# EAGLE design Pure Keys aec-pcb4-inprogress (EAGLE 9.3.1)

## Sheet 1 of 7: ATMEGA328P
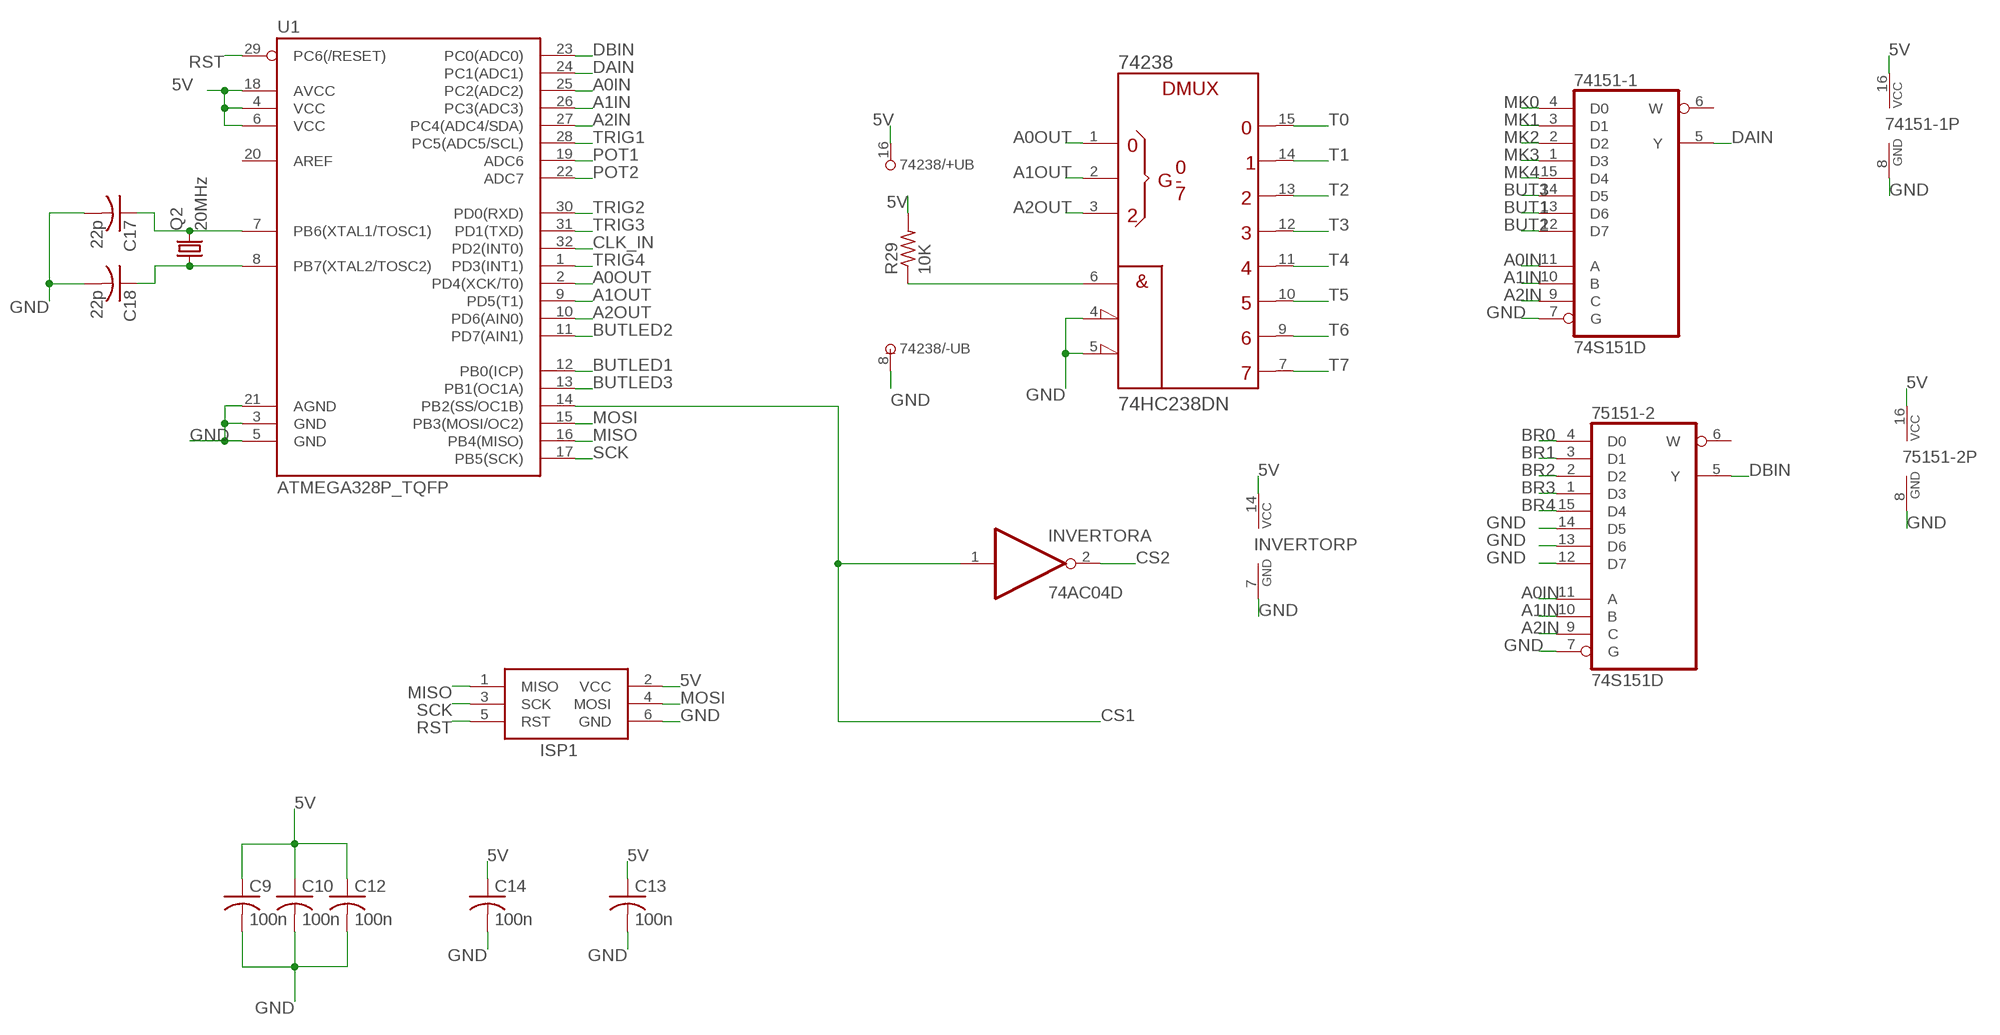
[diagram p0: schematic, sheet 1]

### Parts
74151-1  74S151D  [SO16]
74238  74HC238DN  [SO16]
75151-2  74S151D  [SO16]
C9  100n  C-USC0805K  [C0805K]
C10  100n  C-USC0805K  [C0805K]
C12  100n  C-USC0805K  [C0805K]
C13  100n  C-USC0805K  [C0805K]
C14  100n  C-USC0805K  [C0805K]
C17  22p  C-USC0805K  [C0805K]
C18  22p  C-USC0805K  [C0805K]
INVERTOR  74AC04D  [SO14]
ISP1  AVRISP-6  [AVRISP]
Q2  20MHz  CRYSTALHC49UP  [HC49UP]
R29  10K  R-US_R0805  [R0805]
U1  ATMEGA328P_TQFP  [TQFP32-08]

### Nets
5V [Power]: 74151-1.16(VCC) 74238.16(+UB) 75151-2.16(VCC) C9.1 C10.1 C12.1 C13.1 C14.1 INVERTOR.14(P:VCC) ISP1.2(VCC) R29.2 U1.4(VCC) U1.6(VCC) U1.18(AVCC) ; also sheet 2,4,5,6,7
A0IN [D-Pin]: 74151-1.11(A) 75151-2.11(A) U1.25(PC2(ADC2))
A0OUT: 74238.1(A) U1.2(PD4(XCK/T0))
A1IN [D-Pin]: 74151-1.10(B) 75151-2.10(B) U1.26(PC3(ADC3))
A1OUT [D-Pin]: 74238.2(B) U1.9(PD5(T1))
A2IN [D-Pin]: 74151-1.9(C) 75151-2.9(C) U1.27(PC4(ADC4/SDA))
A2OUT [D-Pin]: 74238.3(C) U1.10(PD6(AIN0))
BR0: 75151-2.4(D0) ; also sheet 3
BR1: 75151-2.3(D1) ; also sheet 3
BR2: 75151-2.2(D2) ; also sheet 3
BR3: 75151-2.1(D3) ; also sheet 3
BR4: 75151-2.15(D4) ; also sheet 3
BUT1: 74151-1.13(D6) ; also sheet 6
BUT2: 74151-1.12(D7) ; also sheet 6
BUT3: 74151-1.14(D5) ; also sheet 6
BUTLED1 [D-Pin]: U1.12(PB0(ICP)) ; also sheet 6
BUTLED2 [D-Pin]: U1.11(PD7(AIN1)) ; also sheet 6
BUTLED3 [D-Pin]: U1.13(PB1(OC1A)) ; also sheet 6
CLK_IN: U1.32(PD2(INT0)) ; also sheet 7
CS1 [D-Pin]: INVERTOR.1(A:I) U1.14(PB2(SS/OC1B)) ; also sheet 5
CS2: INVERTOR.2(A:O) ; also sheet 5
DAIN [D-Pin]: 74151-1.5(Y) U1.24(PC1(ADC1))
DBIN: 75151-2.5(Y) U1.23(PC0(ADC0))
ENOUT1: 74238.6(G1) R29.1
GND [Power]: 74151-1.7(G) 74151-1.8(GND) 74238.4(!G2A) 74238.5(!G2B) 74238.8(-UB) 75151-2.7(G) 75151-2.8(GND) 75151-2.12(D7) 75151-2.13(D6) 75151-2.14(D5) C9.2 C10.2 C12.2 C13.2 C14.2 C17.2 C18.2 INVERTOR.7(P:GND) ISP1.6(GND) U1.3(GND) U1.5(GND) U1.21(AGND) ; also sheet 2,3,4,5,6,7
MISO [D-Pin]: ISP1.1(MISO) U1.16(PB4(MISO))
MK0: 74151-1.4(D0) ; also sheet 3
MK1: 74151-1.3(D1) ; also sheet 3
MK2: 74151-1.2(D2) ; also sheet 3
MK3: 74151-1.1(D3) ; also sheet 3
MK4: 74151-1.15(D4) ; also sheet 3
MOSI [D-Pin]: ISP1.4(MOSI) U1.15(PB3(MOSI/OC2)) ; also sheet 5
N$10 [D-Pin]: C17.1 Q2.2 U1.7(PB6(XTAL1/TOSC1))
N$11 [D-Pin]: C18.1 Q2.1 U1.8(PB7(XTAL2/TOSC2))
POT1 [D-Pin]: U1.19(ADC6) ; also sheet 6
POT2: U1.22(ADC7) ; also sheet 6
RST [D-Pin]: ISP1.5(RST) U1.29(PC6(/RESET))
SCK [D-Pin]: ISP1.3(SCK) U1.17(PB5(SCK)) ; also sheet 5
T0: 74238.15(Y0) ; also sheet 3
T1: 74238.14(Y1) ; also sheet 3
T2: 74238.13(Y2) ; also sheet 3
T3: 74238.12(Y3) ; also sheet 3
T4: 74238.11(Y4) ; also sheet 3
T5: 74238.10(Y5) ; also sheet 3
T6: 74238.9(Y6) ; also sheet 3
T7: 74238.7(Y7) ; also sheet 3
TRIG1 [D-Pin]: U1.28(PC5(ADC5/SCL)) ; also sheet 4
TRIG2 [D-Pin]: U1.30(PD0(RXD)) ; also sheet 4
TRIG3 [D-Pin]: U1.31(PD1(TXD)) ; also sheet 4
TRIG4: U1.1(PD3(INT1)) ; also sheet 4
Unconnected: 74151-1.6(W) 75151-2.6(W) INVERTOR.3(B:I) INVERTOR.4(B:O) INVERTOR.5(C:I) INVERTOR.6(C:O) INVERTOR.8(D:O) INVERTOR.9(D:I) INVERTOR.10(E:O) INVERTOR.11(E:I) INVERTOR.12(F:O) INVERTOR.13(F:I) U1.20(AREF)

## Sheet 2 of 7: Power
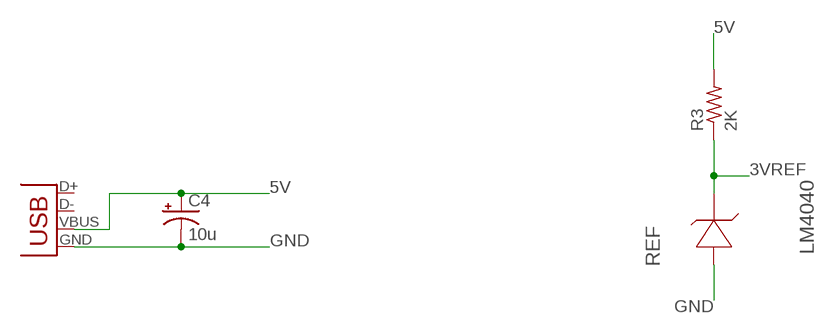
[diagram p1: schematic, sheet 2]

### Parts
C4  10u  CPOL-US153CLV-0505  [153CLV-0505]
JP2  USB-B  USBPTH  [USB-B-PTH]
R3  2K  R-US_R0805  [R0805]
REF  LM4040  LM4040A30IDBZT  [SOT95P237X112-3N]

### Nets
3VREF: R3.1 REF.1(CATHODE) ; also sheet 5
5V [Power]: C4.+ JP2.VBUS R3.2 ; also sheet 1,4,5,6,7
GND [Power]: C4.- JP2.GND REF.2(ANODE) ; also sheet 1,3,4,5,6,7
Unconnected: JP2.D+ JP2.D- REF.3(NC)

## Sheet 3 of 7: Keyboard Connector
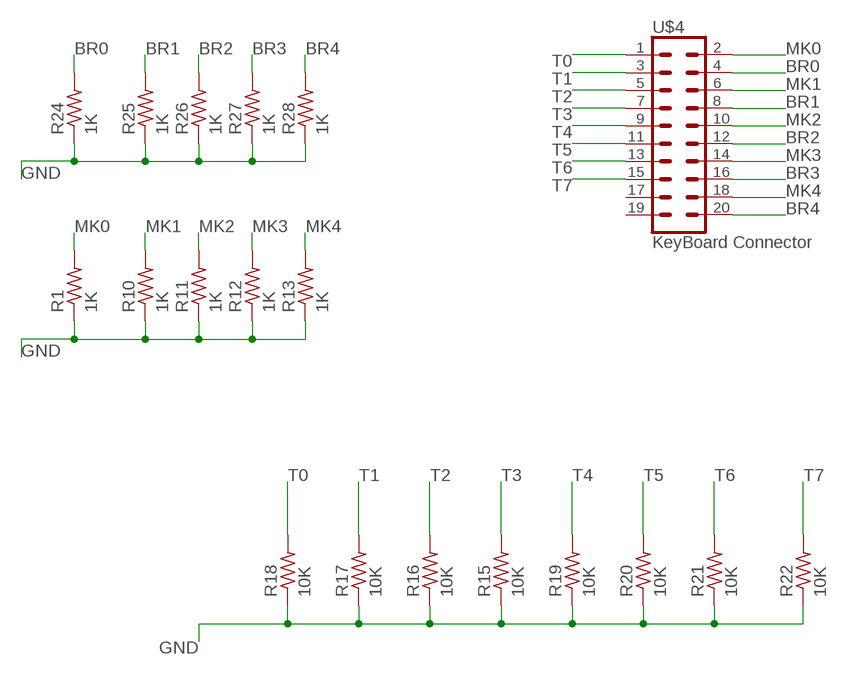
[diagram p2: schematic, sheet 3]

### Parts
R1  1K  R-US_R0805  [R0805]
R10  1K  R-US_R0805  [R0805]
R11  1K  R-US_R0805  [R0805]
R12  1K  R-US_R0805  [R0805]
R13  1K  R-US_R0805  [R0805]
R15  10K  R-US_R0805  [R0805]
R16  10K  R-US_R0805  [R0805]
R17  10K  R-US_R0805  [R0805]
R18  10K  R-US_R0805  [R0805]
R19  10K  R-US_R0805  [R0805]
R20  10K  R-US_R0805  [R0805]
R21  10K  R-US_R0805  [R0805]
R22  10K  R-US_R0805  [R0805]
R24  1K  R-US_R0805  [R0805]
R25  1K  R-US_R0805  [R0805]
R26  1K  R-US_R0805  [R0805]
R27  1K  R-US_R0805  [R0805]
R28  1K  R-US_R0805  [R0805]
U$4  KeyBoard Connector  CONN_10X2  [2X10]

### Nets
BR0: R24.2 U$4.4 ; also sheet 1
BR1: R25.2 U$4.8 ; also sheet 1
BR2: R26.2 U$4.12 ; also sheet 1
BR3: R27.2 U$4.16 ; also sheet 1
BR4: R28.2 U$4.20 ; also sheet 1
GND [Power]: R1.1 R10.1 R11.1 R12.1 R13.1 R15.1 R16.1 R17.1 R18.1 R19.1 R20.1 R21.1 R22.1 R24.1 R25.1 R26.1 R27.1 R28.1 ; also sheet 1,2,4,5,6,7
MK0: R1.2 U$4.2 ; also sheet 1
MK1: R10.2 U$4.6 ; also sheet 1
MK2: R11.2 U$4.10 ; also sheet 1
MK3: R12.2 U$4.14 ; also sheet 1
MK4: R13.2 U$4.18 ; also sheet 1
T0: R18.2 U$4.1 ; also sheet 1
T1: R17.2 U$4.3 ; also sheet 1
T2: R16.2 U$4.5 ; also sheet 1
T3: R15.2 U$4.7 ; also sheet 1
T4: R19.2 U$4.9 ; also sheet 1
T5: R20.2 U$4.11 ; also sheet 1
T6: R21.2 U$4.13 ; also sheet 1
T7: R22.2 U$4.15 ; also sheet 1
Unconnected: U$4.17 U$4.19

## Sheet 4 of 7: Triggers
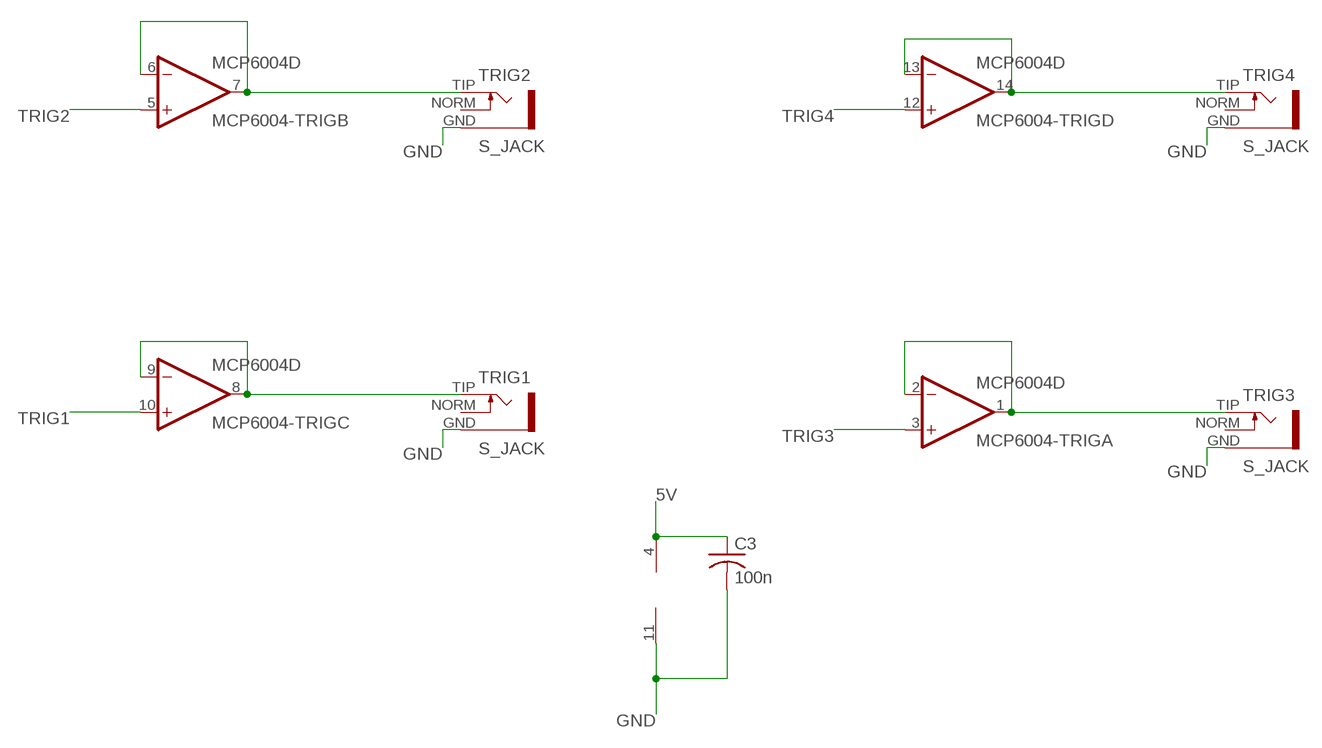
[diagram p3: schematic, sheet 4]

### Parts
C3  100n  C-USC0805K  [C0805K]
MCP6004-TRIG  MCP6004D  [SO14]
TRIG1  S_JACK  [S_JACK]
TRIG2  S_JACK  [S_JACK]
TRIG3  S_JACK  [S_JACK]
TRIG4  S_JACK  [S_JACK]

### Nets
5V [Power]: C3.1 MCP6004-TRIG.4(P:V+) ; also sheet 1,2,5,6,7
GND [Power]: C3.2 MCP6004-TRIG.11(P:V-) TRIG1.GND TRIG2.GND TRIG3.GND TRIG4.GND ; also sheet 1,2,3,5,6,7
N$3: MCP6004-TRIG.6(B:-IN) MCP6004-TRIG.7(B:OUT) TRIG2.TIP
N$4: MCP6004-TRIG.8(C:OUT) MCP6004-TRIG.9(C:-IN) TRIG1.TIP
N$5: MCP6004-TRIG.13(D:-IN) MCP6004-TRIG.14(D:OUT) TRIG4.TIP
N$6: MCP6004-TRIG.1(A:OUT) MCP6004-TRIG.2(A:-IN) TRIG3.TIP
TRIG1 [D-Pin]: MCP6004-TRIG.10(C:+IN) ; also sheet 1
TRIG2 [D-Pin]: MCP6004-TRIG.5(B:+IN) ; also sheet 1
TRIG3 [D-Pin]: MCP6004-TRIG.3(A:+IN) ; also sheet 1
TRIG4: MCP6004-TRIG.12(D:+IN) ; also sheet 1
Unconnected: TRIG1.NORM TRIG2.NORM TRIG3.NORM TRIG4.NORM

## Sheet 5 of 7: CV Out
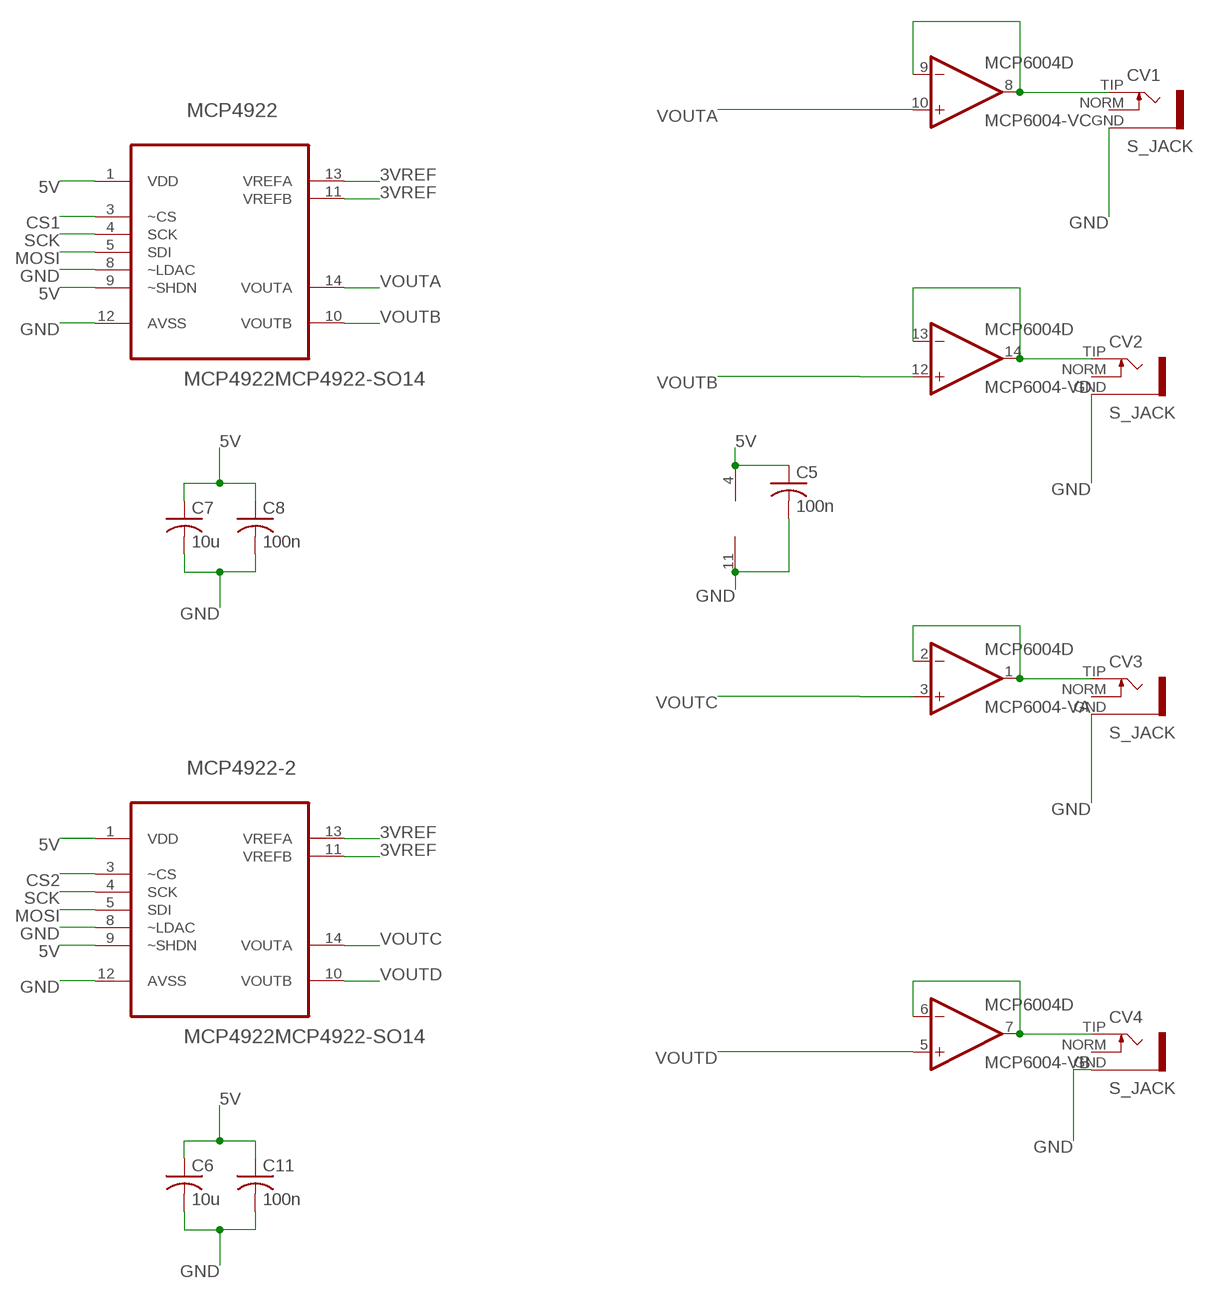
[diagram p4: schematic, sheet 5]

### Parts
C5  100n  C-USC0805K  [C0805K]
C6  10u  C-USC0805K  [C0805K]
C7  10u  C-USC0805K  [C0805K]
C8  100n  C-USC0805K  [C0805K]
C11  100n  C-USC0805K  [C0805K]
CV1  S_JACK  [S_JACK]
CV2  S_JACK  [S_JACK]
CV3  S_JACK  [S_JACK]
CV4  S_JACK  [S_JACK]
MCP4922  MCP4922MCP4922-SO14  [SO14]
MCP4922-2  MCP4922MCP4922-SO14  [SO14]
MCP6004-V  MCP6004D  [SO14]

### Nets
3VREF: MCP4922-2.11(VREFB) MCP4922-2.13(VREFA) MCP4922.11(VREFB) MCP4922.13(VREFA) ; also sheet 2
5V [Power]: C5.1 C6.1 C7.1 C8.1 C11.1 MCP4922-2.1(VDD) MCP4922-2.9(~SHDN) MCP4922.1(VDD) MCP4922.9(~SHDN) MCP6004-V.4(P:V+) ; also sheet 1,2,4,6,7
CS1 [D-Pin]: MCP4922.3(~CS) ; also sheet 1
CS2: MCP4922-2.3(~CS) ; also sheet 1
GND [Power]: C5.2 C6.2 C7.2 C8.2 C11.2 CV1.GND CV2.GND CV3.GND CV4.GND MCP4922-2.8(~LDAC) MCP4922-2.12(AVSS) MCP4922.8(~LDAC) MCP4922.12(AVSS) MCP6004-V.11(P:V-) ; also sheet 1,2,3,4,6,7
MOSI [D-Pin]: MCP4922-2.5(SDI) MCP4922.5(SDI) ; also sheet 1
N$7: CV1.TIP MCP6004-V.8(C:OUT) MCP6004-V.9(C:-IN)
N$25: CV4.TIP MCP6004-V.6(B:-IN) MCP6004-V.7(B:OUT)
N$31: CV3.TIP MCP6004-V.1(A:OUT) MCP6004-V.2(A:-IN)
N$36: CV2.TIP MCP6004-V.13(D:-IN) MCP6004-V.14(D:OUT)
SCK [D-Pin]: MCP4922-2.4(SCK) MCP4922.4(SCK) ; also sheet 1
VOUTA: MCP4922.14(VOUTA) MCP6004-V.10(C:+IN)
VOUTB: MCP4922.10(VOUTB) MCP6004-V.12(D:+IN)
VOUTC: MCP4922-2.14(VOUTA) MCP6004-V.3(A:+IN)
VOUTD: MCP4922-2.10(VOUTB) MCP6004-V.5(B:+IN)
Unconnected: CV1.NORM CV2.NORM CV3.NORM CV4.NORM

## Sheet 6 of 7: Pots and Buttons
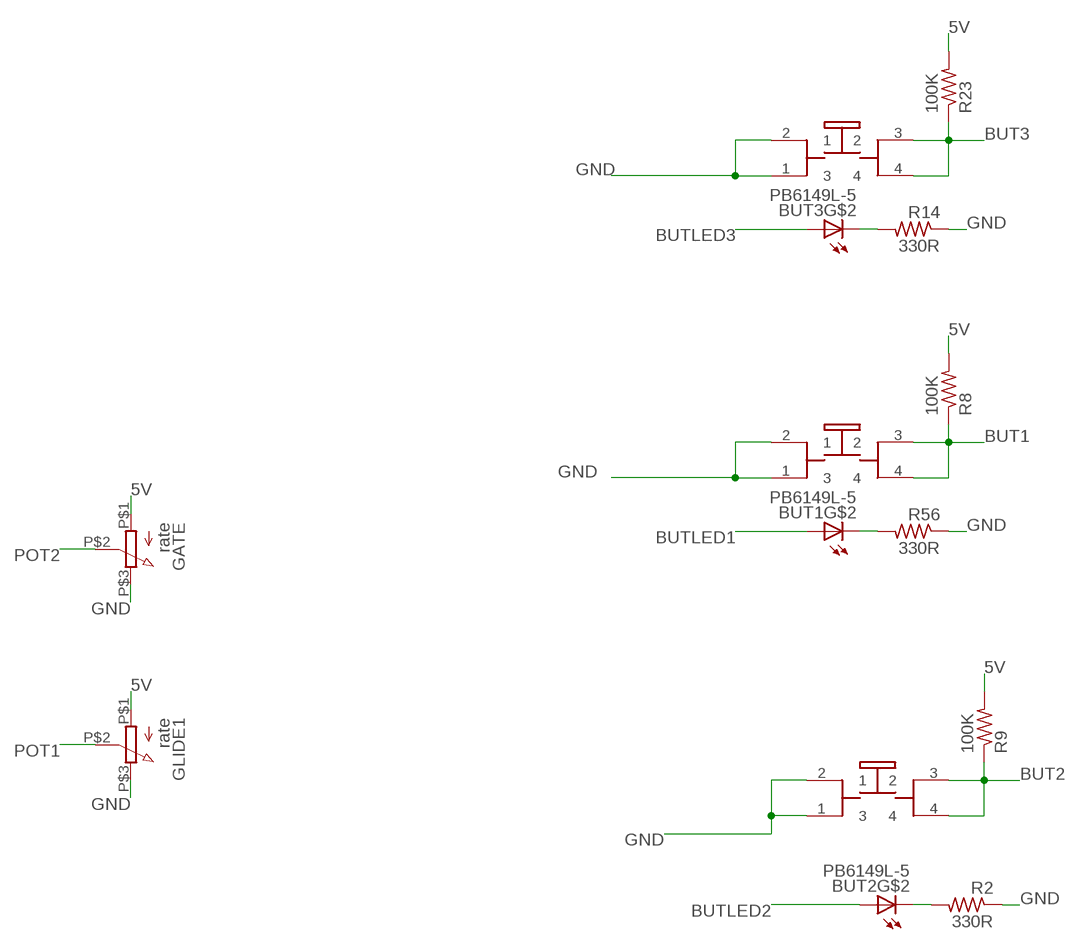
[diagram p5: schematic, sheet 6]

### Parts
BUT1  PB6149L-5  [PB6149L]
BUT2  PB6149L-5  [PB6149L]
BUT3  PB6149L-5  [PB6149L]
GATE  rate  9MMPOT  [POT]
GLIDE1  rate  9MMPOT  [POT]
R2  330R  R-US_R0805  [R0805]
R8  100K  R-US_R0805  [R0805]
R9  100K  R-US_R0805  [R0805]
R14  330R  R-US_R0805  [R0805]
R23  100K  R-US_R0805  [R0805]
R56  330R  R-US_R0805  [R0805]

### Nets
5V [Power]: GATE.P$1 GLIDE1.P$1 R8.2 R9.2 R23.2 ; also sheet 1,2,4,5,7
BUT1: BUT1.3 BUT1.4 R8.1 ; also sheet 1
BUT2: BUT2.3 BUT2.4 R9.1 ; also sheet 1
BUT3: BUT3.3 BUT3.4 R23.1 ; also sheet 1
BUTLED1 [D-Pin]: BUT1.A ; also sheet 1
BUTLED2 [D-Pin]: BUT2.A ; also sheet 1
BUTLED3 [D-Pin]: BUT3.A ; also sheet 1
GND [Power]: BUT1.1 BUT1.2 BUT2.1 BUT2.2 BUT3.1 BUT3.2 GATE.P$3 GLIDE1.P$3 R2.1 R14.1 R56.1 ; also sheet 1,2,3,4,5,7
N$1: BUT3.K(C) R14.2
N$8: BUT2.K(C) R2.2
N$65: BUT1.K(C) R56.2
POT1 [D-Pin]: GLIDE1.P$2 ; also sheet 1
POT2: GATE.P$2 ; also sheet 1

## Sheet 7 of 7: Clock
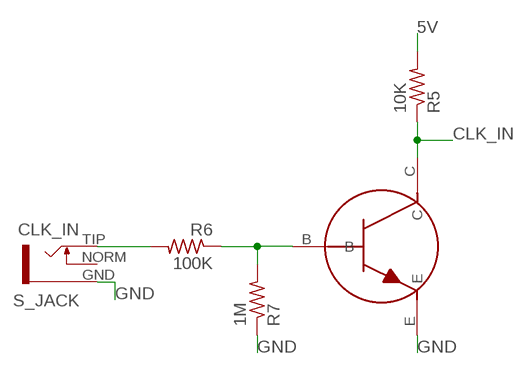
[diagram p6: schematic, sheet 7]

### Parts
CLK_IN  S_JACK  [S_JACK]
CLOCK  2N3904  TRANSISTOR_MMBT3904  [TRANSISTOR_SINGLE_N-TYPE]
R5  10K  R-US_R0805  [R0805]
R6  100K  R-US_R0805  [R0805]
R7  1M  R-US_R0805  [R0805]

### Nets
5V [Power]: R5.2 ; also sheet 1,2,4,5,6
CLK_IN: CLOCK.C R5.1 ; also sheet 1
GND [Power]: CLK_IN.GND CLOCK.E R7.1 ; also sheet 1,2,3,4,5,6
N$17: CLOCK.B R6.1 R7.2
N$26: CLK_IN.TIP R6.2
Unconnected: CLK_IN.NORM

## Library data of the parts
74151-1 75151-2 = 74xx-eu:74*151: Data SELECTOR/MULTIPLEXER; RS-PART: 436-7436
74238 = GMSN-R2Project:74HC238D: 1 of 8 noninverting DECODER/DEMULTIPLEXER; RS-PART: 483-6487 (10off)
BUT1-BUT3 = INSTRUO:PB6149L-5
C3 C5-C14 C17 C18 = rcl:C-US: CAPACITOR, American symbol
C4 = rcl:CPOL-US: POLARIZED CAPACITOR, American symbol
CLK_IN CV1-CV4 TRIG1-TRIG4 = INSTRUO:S_JACK
CLOCK = INSTRUO:TRANSISTOR_MMBT3904; RS-PART: 725-8616
GATE GLIDE1 = GMSN:9MMPOT
INVERTOR = 74xx-eu:74*04: Hex INVERTER; RS-PART: 171-3461 (50 off)
ISP1 = adafruit:AVRISP: AVR ISP HEADER Standard 6 pin header for AVR programming
JP2 = SparkFun-Connectors:USB: USB Connectors USB-B-PTH is fully proven SKU : PRT-00139/CONN-08278 USB-miniB is fully proven SKU : PRT-00587 USB-A-PCB is untested. USB-A-H is throughly reviewed, but untested. Spark Fun Electronics SKU : PRT-00437 USB-B-SMT is throughly reviewed, but untested. Needs silkscreen touching up. USB-A-S has not been used/tested USB-MB-H has not been used/tested USB-MICROB has been used. CONN-09505; PROD_ID: CONN-08278
MCP4922 = GMSN-R2Project:MCP4922; RS-PART: 402-910
MCP4922-2 = GMSN-R2Project:MCP4922
MCP6004-TRIG MCP6004-V = GMSN-R2Project:MCP6004: OP AMP; RS-PART: 628-3481 (10)
Q2 = adafruit:CRYSTAL: CRYSTAL; OC_FARNELL: unknown; OC_NEWARK: unknown
R1 R10-R13 R24-R28 = rcl:R-US_: RESISTOR, American symbol; RS-PART: 223-0427
R2 R3 R5-R9 R14-R23 R29 R56 = rcl:R-US_: RESISTOR, American symbol
REF = GMSN-R2Project:LM4040A30IDBZT: PRECISION MICROPOWER SHUNT VOLTAGE REFERENCE; MPN: LM4040A30IDBZT; OC_FARNELL: 1755108; OC_NEWARK: 58K5870; PACKAGE: 3-SOT-23; RS-PART: 809-6343; SUPPLIER: TEXAS INSTRUMENTS
U1 = SparkFun-IC-Microcontroller:ATMEGA328P_TQFP: Popular 328P in QFP Storefront component: ATmega328 - TQFP <https://www.sparkfun.com/products/13448> (COM-13448) Datasheet <http://www.sparkfun.com/datasheets/Components/SMD/ATMega328.pdf> SparkFun Products SparkFun RedBoard - Programmed with Arduino <https://www.sparkfun.com/products/12757> (DEV-12757) Arduino Pro Mini 328 - 5V/16MHz <https://www.sparkfun.com/products/11113> (DEV-11113) Arduino Pro Mini 328 - 3.3V/8MHz <https://www.sparkfun.com/products/11114> (DEV-11114) SparkFun OpenLog <https://www.sparkfun.com/products/13712> (DEV-13712) SparkFun MicroView - OLED Arduino Module <https://www.sparkfun.com/products/12923> (DEV-12923) SparkFun Digital Sandbox <https://www.sparkfun.com/products/12651> (DEV-12651) SparkFun PicoBoard <https://www.sparkfun.com/products/11888> (WIG-11888) Arduino Fio <https://www.sparkfun.com/products/10116> (DEV-10116) LilyPad Arduino 328 Main Board <https://www.sparkfun.com/products/13342> (DEV-13342) SparkFun RedStick <https://www.sparkfun.com/products/13741> (DEV-13741) LilyPad MP3 <https://www.sparkfun.com/products/11013> (DEV-11013) LilyPad Arduino SimpleSnap <https://www.sparkfun.com/products/10941> (DEV-10941) SparkFun Stepoko <https://www.sparkfun.com/products/13899> (ROB-13899) SparkFun Geiger Counter <https://www.sparkfun.com/products/11345> (SEN-11345) SparkFun EL Sequencer <https://www.sparkfun.com/products/12781> (COM-12781) Arduino Pro 328 - 5V/16MHz <https://www.sparkfun.com/products/10915> (DEV-10915) CryptoCape <https://www.sparkfun.com/products/12773> (DEV-12773) SparkFun IR Thermometer Evaluation Board - MLX90614 <https://www.sparkfun.com/products/10740> (SEN-10740) SparkFun RedBot Mainboard <https://www.sparkfun.com/products/12097> (ROB-12097) Arduino Pro 328 - 3.3V/8MHz <https://www.sparkfun.com/products/10914> (DEV-10914) SparkFun Block for Intel® Edison - Arduino <https://www.sparkfun.com/products/13036> (DEV-13036) SparkFun Simon Says - Surface Mount Soldering Kit <https://www.sparkfun.com/products/10935> (KIT-10935) SparkFun 7-Segment Serial Display - Red <https://www.sparkfun.com/products/11441> (COM-11441) SparkFun 7-Segment Serial Display - White <https://www.sparkfun.com/products/11629> (COM-11629) SparkFun 7-Segment Serial Display - Yellow <https://www.sparkfun.com/products/11443> (COM-11443) SparkFun 7-Segment Serial Display - Kelly Green <https://www.sparkfun.com/products/11440> (COM-11440) SparkFun 7-Segment Serial Display - Blue <https://www.sparkfun.com/products/11442> (COM-11442) SparkFun OpenSegment Serial Display - 20mm (Blue) <https://www.sparkfun.com/products/11647> (COM-11647) SparkFun OpenSegment Serial Display - 20mm (Green) <https://www.sparkfun.com/products/11646> (COM-11646) SparkFun OpenSegment Serial Display - 20mm (White) <https://www.sparkfun.com/products/11648> (COM-11648) SparkFun OpenSegment Serial Display - 20mm (Red) <https://www.sparkfun.com/products/11644> (COM-11644) SparkFun OpenSegment Serial Display - 20mm (Yellow) <https://www.sparkfun.com/products/11645> (COM-11645) SparkFun OpenSegment Shield <https://www.sparkfun.com/products/13190> (DEV-13190); PROD_ID: IC-09069; RS-PART: 131-0271
U$4 = SparkFun-Connectors:CONN_10X2: Multi connection point. Often used as Generic Header-pin footprint for 0.1 inch spaced/style header connections On any of the 0.1 inch spaced packages, you can populate with these: Break Away Headers - Straight <https://www.sparkfun.com/products/116> (PRT-00116) Break Away Male Headers - Right Angle <https://www.sparkfun.com/products/553> (PRT-00553) Female Headers <https://www.sparkfun.com/products/115> (PRT-00115) Break Away Headers - Machine Pin <https://www.sparkfun.com/products/117> (PRT-00117) Break Away Female Headers - Swiss Machine Pin <https://www.sparkfun.com/products/743> (PRT-00743); RS-PART: 669-5364

## Net classes
0 default: width 0.254 mm
1 Power: width 0.61 mm
2 D-Pin: width 0.203 mm

## Board
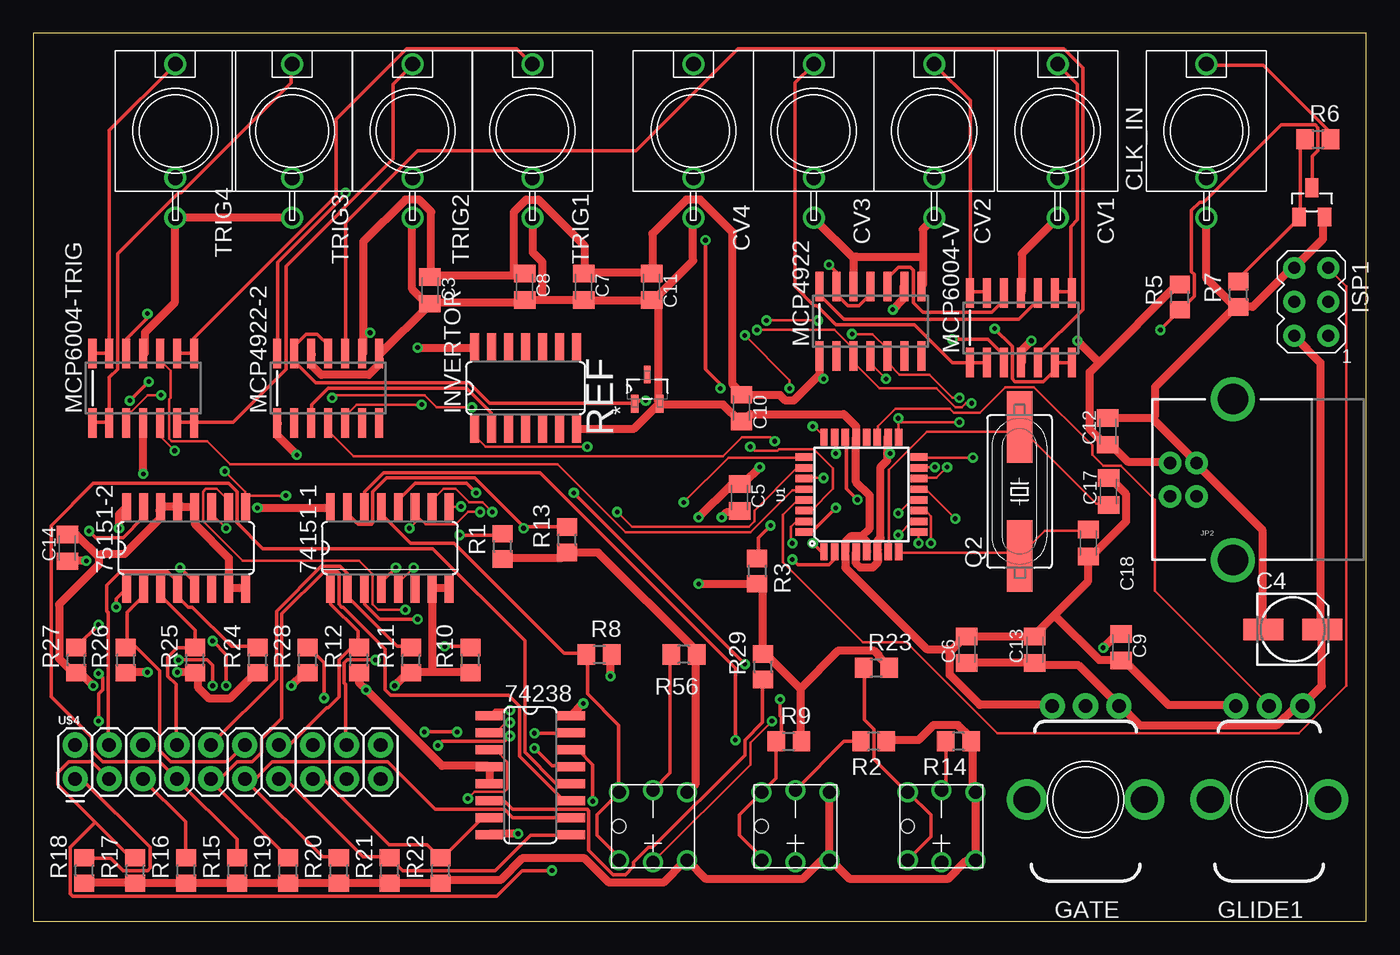
[diagram p7: board, top side]
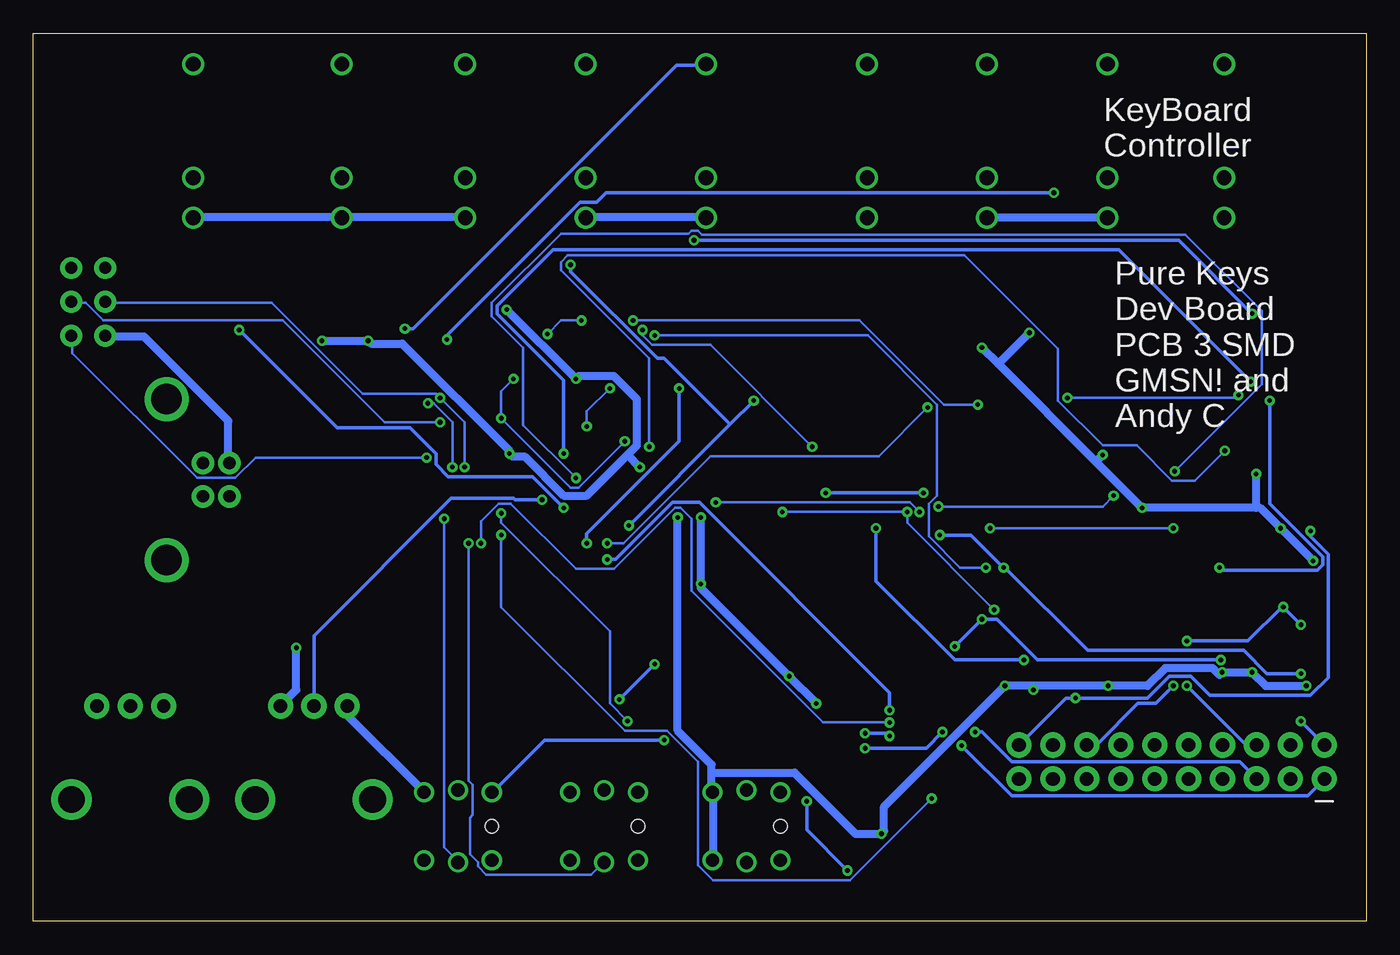
[diagram p8: board, bottom side, seen from below]

Size 99.73 x 66.43 mm. Coordinates in mm from the lower left corner, seen from the top.
Outline: 0,0 99.73,0 99.73,66.43 0,66.43 0,0
Copper layers (1*16): Top 0.035mm / dielectric 1.5mm / Bottom 0.035mm
Design rules "default": minimum track width 6mil, minimum drill 0.35mm, track to track 6mil, track to pad 6mil, pad to pad 6mil, via to via 6mil, smd to smd 6mil, copper to edge 40mil, drill to drill 6mil, minimum pad ring 10mil, minimum via ring 8mil, stop-mask expansion 4mil, vias tented up to drill 0mil, thermal gap 10mil

### Footprints (pad centres in the part's own frame; a part is rotated, then mirrored left to right if it is on the bottom)
SO16 = smd 0.66 x 2.032: 1 -4.445,-3.073; 2 -3.175,-3.073; 3 -1.905,-3.073; 4 -0.635,-3.073; 5 0.635,-3.073; 6 1.905,-3.073; 7 3.175,-3.073; 8 4.445,-3.073; 9 4.445,3.073; 10 3.175,3.073; 11 1.905,3.073; 12 0.635,3.073; 13 -0.635,3.073; 14 -1.905,3.073; 15 -3.175,3.073; 16 -4.445,3.073
PB6149L = drill 1: 1 2.54,-2.54; 2 2.54,2.54; 3 -2.54,-2.54; 4 -2.54,2.54; A 0,-2.7; K 0,2.7 | hole 1: -2.54,0
C0805K = smd 1.3 x 1.6: 1 -1,0; 2 1,0
153CLV-0505 = smd 3 x 1.6: + 2.2,0; - -2.2,0
S_JACK = drill 1.1: GND 0,-6.5; NORM 0,-3.5; TIP 0,5
TRANSISTOR_SINGLE_N-TYPE = smd 1 x 1.4: B -0.95,-1.1; C 0,1.1; E 0.95,-1.1
POT = drill 1 pad 1.88: P$1 -2.5,-7; P$2 0,-7; P$3 2.5,-7 | drill 2 pad 2.68: P$4 -4.4,0; P$5 4.4,0
SO14 = smd 0.66 x 2.032: 1 -3.81,-3.073; 2 -2.54,-3.073; 3 -1.27,-3.073; 4 0,-3.073; 5 1.27,-3.073; 6 2.54,-3.073; 7 3.81,-3.073; 8 3.81,3.073; 9 2.54,3.073; 10 1.27,3.073; 11 0,3.073; 12 -1.27,3.073; 13 -2.54,3.073; 14 -3.81,3.073
AVRISP = drill 0.9 pad 1.626: 1 -1.27,2.54; 2 1.27,2.54; 3 -1.27,0; 4 1.27,0; 5 -1.27,-2.54; 6 1.27,-2.54
USB-B-PTH = drill 0.914 pad 1.676: D+ 0,1.25; D- 1.981,1.25; GND 0,-1.25; VBUS 1.981,-1.25 | drill 2.286: S1 -2.718,-6.02; S2 -2.718,6.02
SO14' = smd 0.6 x 2.2: 1 -3.81,-2.6; 2 -2.54,-2.6; 3 -1.27,-2.6; 4 0,-2.6; 5 1.27,-2.6; 6 2.54,-2.6; 7 3.81,-2.6; 8 3.81,2.6; 9 2.54,2.6; 10 1.27,2.6; 11 0,2.6; 12 -1.27,2.6; 13 -2.54,2.6; 14 -3.81,2.6
HC49UP = smd 5.334 x 1.93: 1 -4.826,0; 2 4.826,0
R0805 = smd 1.3 x 1.5: 1 -0.95,0; 2 0.95,0
SOT95P237X112-3N = smd 1.321 x 0.559: 1 -1.092,0.94; 2 -1.092,-0.94 | smd 1.321 x 0.508: 3 1.092,0
TQFP32-08 = smd 1.27 x 0.559: 1 -4.293,2.8; 2 -4.293,2; 3 -4.293,1.2; 4 -4.293,0.4; 5 -4.293,-0.4; 6 -4.293,-1.2; 7 -4.293,-2; 8 -4.293,-2.8; 17 4.293,-2.8; 18 4.293,-2; 19 4.293,-1.2; 20 4.293,-0.4; 21 4.293,0.4; 22 4.293,1.2; 23 4.293,2; 24 4.293,2.8 | smd 0.559 x 1.27: 9 -2.8,-4.293; 10 -2,-4.293; 11 -1.2,-4.293; 12 -0.4,-4.293; 13 0.4,-4.293; 14 1.2,-4.293; 15 2,-4.293; 16 2.8,-4.293; 25 2.8,4.293; 26 2,4.293; 27 1.2,4.293; 28 0.4,4.293; 29 -0.4,4.293; 30 -1.2,4.293; 31 -2,4.293; 32 -2.8,4.293
2X10 = drill 1.016 pad 1.88: 1 0,0; 2 0,2.54; 3 2.54,0; 4 2.54,2.54; 5 5.08,0; 6 5.08,2.54; 7 7.62,0; 8 7.62,2.54; 9 10.16,0; 10 10.16,2.54; 11 12.7,0; 12 12.7,2.54; 13 15.24,0; 14 15.24,2.54; 15 17.78,0; 16 17.78,2.54; 17 20.32,0; 18 20.32,2.54; 19 22.86,0; 20 22.86,2.54

### Placement (x,y rotation side)
74151-1  26.67,27.94 0 top
74238  37.18,10.94 270 top
75151-2  11.43,27.94 0 top
BUT1  46.37,7.12 0 top
BUT2  57.03,7.12 0 top
BUT3  67.96,7.12 0 top
C3  29.67,47.21 270 top
C4  94.24,21.85 0 top
C5  52.85,31.71 270 top
C6  69.85,20.32 90 top
C7  41.18,47.48 270 top
C8  36.76,47.48 270 top
C9  81.39,20.51 270 top
C10  52.99,38.4 270 top
C11  46.27,47.48 270 top
C12  80.39,36.66 90 top
C13  74.93,20.32 90 top
C14  2.54,27.94 90 top
C17  80.45,32.16 90 top
C18  78.95,28.31 270 top
CLK_IN  87.78,59.14 0 top
CLOCK  95.67,53.79 0 top
CV1  76.65,59.14 0 top
CV2  67.41,59.14 0 top
CV3  58.4,59.14 0 top
CV4  49.39,59.14 0 top
GATE  78.74,9.12 180 top
GLIDE1  92.48,9.12 180 top
INVERTOR  36.83,39.9 0 top
ISP1  95.63,46.35 180 top
JP2  87.05,33.05 180 top
MCP4922  MCP4922MCP4922-SO14  [SO14']  62.65,44.9 0 top
MCP4922-2  MCP4922MCP4922-SO14  [SO14']  22.05,39.9 0 top
MCP6004-TRIG  MCP6004D  [SO14']  8.23,39.9 0 top
MCP6004-V  MCP6004D  [SO14']  73.89,44.4 0 top
Q2  73.8,32.16 90 top
R1  35.12,28.05 90 top
R2  62.88,13.47 180 top
R3  54.16,26.21 270 top
R5  85.78,46.71 90 top
R6  96.12,58.52 0 top
R7  90.17,46.91 90 top
R8  42.33,19.97 0 top
R9  56.53,13.47 0 top
R10  32.7,19.55 90 top
R11  28.28,19.55 90 top
R12  24.36,19.55 90 top
R13  39.94,28.55 90 top
R14  69.23,13.47 180 top
R15  15.24,3.81 90 top
R16  11.43,3.81 90 top
R17  7.62,3.81 90 top
R18  3.81,3.81 90 top
R19  19.05,3.81 90 top
R20  22.86,3.81 90 top
R21  26.67,3.81 90 top
R22  30.48,3.81 90 top
R23  63.08,18.97 0 top
R24  16.79,19.55 90 top
R25  12.1,19.55 90 top
R26  6.91,19.55 90 top
R27  3.22,19.55 90 top
R28  20.53,19.55 90 top
R29  54.61,19.05 90 top
R56  48.68,19.97 180 top
REF  45.94,39.82 90 top
TRIG1  37.34,59.14 0 top
TRIG2  28.37,59.14 0 top
TRIG3  19.36,59.14 0 top
TRIG4  10.62,59.14 0 top
U1  61.96,31.93 90 top
U$4  3.12,10.66 0 top

### Tracks (layer width: path | path; a pad name or v marks a point on that pad's centre or on a via)
3VREF  (via drill 0.35)
  Top 0.254: MCP4922.11 62.59,47.5 62.59,46.89 61.77,46.08 60.96,46.08 60.15,46.89 60.15,47.5 MCP4922.13 60.05,47.6 60.05,48.62 v59.54,49.12 | v55.17,29.62 54.25,28.7 54.25,27.18 R3.1 | v45.82,38.96 45.31,38.96 45.11,38.76 REF.1 44.91,38.76 34.14,38.76 32.61,40.28 21.13,40.28 19.61,41.81 19.61,42.42 MCP4922-2.13 19.51,42.62 19.51,43.03 20.42,43.94 21.23,43.94 22.05,43.13 22.05,42.52 MCP4922-2.11
  Bottom 0.254: v45.82,38.96 47.6,37.19 | 47.6,37.19 v55.17,29.62 | v59.54,49.12 59.54,48.62 53.03,42.11 52.53,42.11 47.6,37.19
5V  (via drill 0.35)
  Top 0.61: 24.69,44.04 24.69,50.85 27.84,54 28.85,54 29.77,53.09 29.77,48.62 C3.1 29.77,48.31 36.58,48.31 36.68,48.41 C8.1 35.97,48.51 35.97,53.09 36.88,54 37.8,54 41.25,50.55 41.25,48.82 C7.1 41.25,48.51 46.23,48.51 C11.1 46.33,48.82 46.33,51.46 48.87,54 49.89,54 52.32,51.56 52.32,40.18 52.83,39.68 C10.1 53.03,39.37 55.88,39.37 56.29,38.96 56.9,38.96 58.83,40.89 | 24.69,44.04 24.69,42.52 MCP4922-2.9 | v3.96,26.98 2.54,26.98 C14.1 | v6.4,29.41 6.4,30.43 75151-2.16 | v16.76,30.94 22.15,30.94 74151-1.16 | v28.75,42.93 33.02,42.93 INVERTOR.14 | v8.23,33.48 8.23,37.24 MCP6004-TRIG.4 | v19.71,34.9 18.29,36.32 18.29,37.24 MCP4922-2.1 | v25.2,44.04 24.69,44.04 | 57.4,17.42 57.4,13.56 R9.2 | 57.4,17.42 54.86,19.96 R29.2 54.56,20.07 54.56,24.94 54.25,25.25 R3.2 53.95,25.25 v49.78,25.25 | 57.4,17.42 60.25,20.27 62.89,20.27 63.3,19.86 63.3,19.76 64.01,19.05 R23.2 | v43.18,18.34 43.18,19.96 R8.2 | v41.15,16.31 40.23,15.39 74238.16 | v49.78,30.23 52.22,32.66 52.83,32.66 C5.1 53.14,32.77 v54.36,33.98 | C6.1 69.9,19.36 74.88,19.36 C13.1 75.18,19.15 78.23,19.15 81.18,16.2 GATE.P$1 81.48,16 82.8,14.68 93.07,14.68 94.49,16.1 94.69,16.1 GLIDE1.P$1 95,16.2 96.42,17.63 96.42,21.79 C4.+ 96.32,22.1 96.32,41.81 94.39,43.74 ISP1.2 | v80.06,20.47 81.08,21.49 81.38,21.49 C9.1 | 58.83,40.89 58.83,42.22 MCP4922.1 | v64.31,45.77 65.13,46.58 65.13,47.5 MCP4922.9 | v59.13,40.59 58.83,40.89 | U1.4 61.57,27.58 61.57,26.77 61.87,26.47 62.79,26.47 63.2,26.87 63.2,27.58 U1.6 63.2,27.89 63.2,28.5 63.4,28.7 63.4,33.98 63.91,34.49 63.91,35 | 63.91,35 63.91,36.22 U1.18 | 79.76,41.81 79.05,41.1 79.05,36.83 80.16,35.71 80.37,35.71 C12.1 80.67,35.61 81.89,34.39 85.04,34.39 JP2.VBUS
  Top 0.61: 79.76,41.81 85.55,47.6 85.75,47.6 R5.2 | v74.68,43.43 73.97,42.72 73.97,41.81 MCP6004-V.4 | 79.76,41.81 v78.13,43.43 | v64.11,35 63.91,35
  Bottom 0.61: v3.96,26.98 v6.4,29.41 7.92,30.94 8.23,30.94 | 8.23,30.94 v16.76,30.94 20.22,34.39 | 20.22,34.39 27.53,41.71 | 27.53,41.71 v28.75,42.93 | 8.23,30.94 v8.23,33.48 | 20.22,34.39 v19.71,34.9 | 27.53,41.71 v25.2,44.04 | v41.15,16.31 v43.18,18.34 49.78,24.94 v49.78,25.25 v49.78,30.23 | v80.06,20.47 80.06,17.32 81.18,16.2 GATE.P$1 | ISP1.2 94.28,43.74 91.44,43.74 85.14,37.44 85.14,34.39 JP2.VBUS | v64.31,45.77 v59.13,40.59 58.93,40.79 56.29,40.79 54.56,39.07 54.56,35.61 55.27,34.9 | v78.13,43.43 v74.68,43.43 74.47,43.23 72.14,43.23 64.11,35.2 v64.11,35 63.91,34.8 62.99,34.8 60.05,31.85 58.32,31.85 55.27,34.9 | 55.27,34.9 v54.36,33.98
A0IN  (via drill 0.35)
  Top 0.203: v48.67,31.34 52.02,34.7 57.61,34.7 U1.25 | v33.43,30.63 32.51,30.63 31.6,29.72 29.36,29.72 28.65,30.43 28.65,30.94 74151-1.11 28.85,30.12 v28.14,29.41 | v14.43,29.41 13.41,30.43 13.41,30.94 75151-2.11
  Bottom 0.203: v48.67,31.34 34.14,31.34 v33.43,30.63 | v28.14,29.41 v14.43,29.41
A0OUT  (via drill 0.35)
  Top 0.254: v56.79,27.08 57.2,26.67 59.54,26.67 59.94,27.08 59.94,27.58 U1.2 | v35.66,15.8 34.54,15.8 34.14,15.39 74238.1
  Bottom 0.254: v56.79,27.08 56.19,27.08 51.92,31.34 49.89,31.34 35.66,17.12 v35.66,15.8
A1IN  (via drill 0.35)
  Top 0.203: v43.69,30.63 44.81,29.52 53.54,29.52 53.95,29.92 53.95,30.73 57.1,33.88 57.61,33.88 U1.26 | v34.34,30.63 33.63,31.34 32.61,31.34 31.6,32.36 30.68,32.36 29.87,31.55 29.87,31.04 74151-1.10 | v27.84,23.32 25.81,23.32 25.4,23.72 25.4,25.96 24.38,26.98 15.65,26.98 12.7,29.92 12.7,32.16 12.9,32.36 13.72,32.36 14.53,31.55 14.53,31.04 75151-2.10
  Bottom 0.203: v43.69,30.63 v34.34,30.63 34.34,29.82 v27.84,23.32
A1OUT  (via drill 0.35)
  Top 0.203: v66.24,28.3 66.24,29.11 U1.9 | v35.66,14.88 35.36,14.88 34.65,14.17 34.14,14.17 74238.2
  Bottom 0.203: v66.24,28.3 66.24,29.92 64.92,31.24 64.01,31.24 59.13,26.37 56.29,26.37 51.71,30.94 51.31,30.94 50.49,30.12 50.49,24.74 40.64,14.88 v35.66,14.88
A2IN  (via drill 0.35)
  Top 0.203: v59.13,33.17 57.71,33.17 U1.27 | v14.33,33.68 15.85,32.16 15.85,31.85 | 15.85,31.85 15.85,31.04 75151-2.9 15.85,31.85 | v32,31.04 31.19,31.04 74151-1.9 | 15.85,31.85 v18.9,31.85
  Bottom 0.203: v59.13,33.17 63.09,37.13 63.09,42.93 65.43,45.26 65.43,46.28 60.25,51.46 50.7,51.46 50.49,51.66 49.99,51.66 49.68,51.36 13.51,51.36 7.82,45.67 7.82,40.18 v14.33,33.68 | v32,31.04 19.71,31.04 v18.9,31.85
A2OUT  (via drill 0.35)
  Top 0.203: v64.72,28.91 65.73,29.92 U1.10 | v32.51,9.2 33.02,9.7 35.26,9.7 35.46,9.91 35.46,11.94 34.65,12.75 34.14,12.75 74238.3
  Bottom 0.203: v64.72,28.91 64.72,23.52 55.47,14.27 52.32,14.27 49.99,11.94 49.99,4.22 48.87,3.1 38.61,3.1 v32.51,9.2
BR0
  Top 0.254: R24.2 16.76,20.57 14.83,20.57 11.89,23.52 11.58,23.52 10.87,24.23 10.87,24.84 75151-2.4 10.77,24.94 10.77,25.45 10.06,26.16 6.5,26.16 5.49,25.15 5.49,23.22 5.59,23.11 5.59,13.26 U$4.4
BR1
  Top 0.254: 75151-2.3 9.55,24.84 9.55,24.33 12.09,21.79 12.09,20.57 R25.2 11.99,20.47 10.77,20.47 10.06,19.76 10.06,18.34 10.67,17.73 10.67,13.26 U$4.8
BR2
  Top 0.254: 75151-2.2 8.23,24.84 8.23,24.33 7.01,23.11 7.01,20.57 R26.2 7.11,20.57 7.62,20.57 9.45,18.74 9.45,12.75 10.26,11.94 14.53,11.94 15.75,13.16 U$4.12
BR3  (via drill 0.35)
  Top 0.254: v4.88,22.2 3.25,20.57 R27.2 | v6.2,23.52 6.2,24.13 6.91,24.84 75151-2.1 | v14.43,17.63 14.43,19.96 v13.41,20.98
  Bottom 0.254: v4.88,22.2 v6.2,23.52 6.3,23.52 8.84,20.98 v13.41,20.98 | v14.43,17.63 15.75,16.31 17.07,16.31 20.12,13.26 20.83,13.26 U$4.16
BR4  (via drill 0.35)
  Top 0.254: v21.74,16.71 21.74,19.36 20.62,20.47 R28.2 | v4.17,29.21 4.67,28.7 6.71,28.7 8.23,30.23 8.23,30.94 75151-2.15
  Bottom 0.254: U$4.20 25.91,13.26 22.45,16.71 v21.74,16.71 16.36,16.71 14.73,18.34 13.11,18.34 11.68,16.92 4.17,16.92 2.85,18.24 2.85,27.48 4.17,28.8 v4.17,29.21
BUT1
  Top 0.254: 74151-1.13 26.11,30.94 26.11,30.43 28.25,28.3 31.5,28.3 39.73,20.07 41.35,20.07 R8.1 41.45,19.96 41.45,17.02 43.79,14.68 43.79,9.7 BUT1.4 43.79,9.6 42.16,7.98 42.16,6.45 43.79,4.83 43.79,4.62 BUT1.3
BUT2  (via drill 0.35)
  Top 0.254: v33.12,32.05 32.41,32.77 28.55,32.77 27.33,31.55 27.33,31.04 74151-1.12 | v53.24,19.25 v40.44,32.05 | v55.88,16.61 55.88,15.39 55.98,15.29 55.98,13.87 55.68,13.56 R9.1 55.58,10.72 54.56,9.7 BUT2.4 54.46,9.6 52.83,7.98 52.83,6.45 54.46,4.83 54.46,4.62 BUT2.3
  Bottom 0.254: v40.44,32.05 v33.12,32.05 | v55.88,16.61 v53.24,19.25
BUT3  (via drill 0.35)
  Top 0.254: R23.1 62.18,18.95 62.18,15.09 62.89,14.38 62.89,12.14 65.33,9.7 BUT3.4 65.53,9.6 67.16,7.98 67.16,6.35 65.43,4.62 BUT3.3 | v52.53,13.56 52.53,18.95 37.9,33.58 26.21,33.58 24.79,32.16 24.79,31.04 74151-1.14
  Bottom 0.254: v52.53,13.56 61.47,13.56 65.33,9.7 BUT3.4
BUTLED1  (via drill 0.35)
  Top 0.203: v64.72,30.53 65.63,31.45 66.24,31.45 U1.12 | v55.27,14.99 53.65,13.36 53.65,11.73 46.43,4.52 BUT1.A
  Bottom 0.203: v64.72,30.53 64.72,29.82 56.59,21.69 56.59,16.31 v55.27,14.99
BUTLED2  (via drill 0.35)
  Top 0.203: v67.16,28.3 67.16,30.33 66.85,30.63 66.34,30.63 U1.11
  Bottom 0.203: v67.16,28.3 67.16,10.52 66.85,10.21 66.85,7.98 67.06,7.77 67.06,5.03 66.45,4.42 66.45,4.12 65.84,3.5 58.01,3.5 57.1,4.42 BUT2.A
BUTLED3  (via drill 0.35)
  Top 0.203: v68.99,30.12 66.85,32.26 66.34,32.26 U1.13
  Bottom 0.203: v68.99,30.12 68.99,5.54 67.97,4.52 BUT3.A
CLK_IN  (via drill 0.35)
  Top 0.254: v60.05,30.94 58.32,29.21 57.71,29.21 U1.32 | v84.33,44.25 85.75,45.67 R5.1 85.85,45.77 86.87,46.79 86.87,48.41 86.67,48.62 86.67,53.19 87.27,53.8 87.58,53.8 93.37,59.59 95.91,59.59 96.11,59.38 96.11,57.66 95.71,57.25 95.71,54.91 CLOCK.C
  Bottom 0.254: v60.05,30.94 62.38,33.27 68.68,33.27 69.6,34.19 69.6,35 71.53,36.93 77.01,36.93 v84.33,44.25
CS1  (via drill 0.35)
  Top 0.203: v68.38,33.98 67.56,33.17 66.34,33.17 U1.14 | v70.21,38.76 69.8,38.76 69.49,38.46 68.99,38.46 67.56,39.88 63.3,39.88 61.47,41.71 61.47,42.22 MCP4922.3 61.37,42.32 61.37,42.82 59.94,44.25 v54.15,44.25 | INVERTOR.1 33.02,36.32 33.83,35.51 v41.45,35.51
  Bottom 0.203: v68.38,33.98 68.38,37.34 69.8,38.76 v70.21,38.76 | v41.45,35.51 49.07,43.13 53.44,43.13 54.15,43.84 v54.15,44.25
CS2
  Top 0.254: INVERTOR.2 34.24,36.83 34.24,38.05 32.41,39.88 22.05,39.88 20.83,38.66 20.83,37.34 MCP4922-2.3
DAIN  (via drill 0.35)
  Top 0.203: v58.32,37.03 58.42,37.03 59.13,36.32 U1.24 | v56.59,39.88 56.59,40.49 v53.24,43.84 | v28.45,26.47 27.33,25.35 27.33,24.94 74151-1.5
  Bottom 0.203: v58.32,37.03 58.32,38.15 v56.59,39.88 | v53.24,43.84 37.29,43.84 32.11,38.66 32.11,31.85 32.72,31.24 32.72,28.8 30.38,26.47 v28.45,26.47
DBIN  (via drill 0.35)
  Top 0.254: v60.05,35 60.05,36.22 U1.23 | v7.21,38.96 v8.64,40.39 | v10.97,26.47 11.99,25.45 11.99,24.94 75151-2.5
  Bottom 0.254: v60.05,35 60.05,40.49 65.02,45.47 65.02,46.08 60.86,50.24 18.49,50.24 v8.64,40.39 | v7.21,38.96 7.21,31.24 3.25,27.28 3.25,26.67 3.66,26.26 10.77,26.26 v10.97,26.47
ENOUT1
  Top 0.254: R29.1 54.56,18.03 54.56,14.88 53.24,13.56 53.24,12.45 46.33,5.54 46.02,5.54 44.91,4.42 44.91,4.12 44.3,3.5 43.38,3.5 41.55,5.33 41.55,8.28 41.45,8.38 35.87,8.38 35.26,8.99 34.14,8.99 74238.6
GND  (via drill 0.35)
  Top 0.61: 4.88,27.28 4.88,26.67 1.93,23.72 1.93,19.66 2.95,18.64 3.15,18.64 R27.1 3.45,18.44 3.66,18.44 v4.47,17.63 | 4.88,27.28 3.25,28.91 2.54,28.91 C14.2 | 75151-2.8 15.85,24.94 14.63,24.94 75151-2.7 14.63,25.25 14.63,27.18 12.09,29.72 12.09,30.73 75151-2.12 11.99,31.04 11.07,31.04 75151-2.13 10.77,31.04 9.55,31.04 75151-2.14 9.45,30.73 9.45,30.12 6.81,27.48 5.08,27.48 4.88,27.28 | R12.1 24.38,18.54 24.38,17.83 v24.89,17.32 30.58,11.63 34.04,11.63 74238.4 34.14,11.33 34.14,10.31 74238.5 | 74151-1.8 31.09,24.94 29.87,24.94 74151-1.7 29.87,24.64 29.87,18.64 | 29.87,18.64 32.61,18.64 R10.1 | 29.87,18.64 28.35,18.64 R11.1 28.04,18.44 27.84,18.44 v27.03,17.63 | v8.53,18.64 7.01,18.64 R26.1 | v10.77,18.64 12.09,18.64 R25.1 12.29,18.34 12.29,17.53 13.11,16.71 14.73,16.71 16.56,18.54 16.76,18.54 R24.1 | v19.3,17.63 20.22,18.54 20.52,18.54 R28.1 | 76.4,22.91 75.08,21.59 C13.2 74.88,21.29 69.9,21.29 C6.2 69.6,21.18 68.58,20.17 | 76.4,22.91 78.94,25.45 78.94,27.28 C18.2 79.25,27.38 81.79,29.92 81.79,31.95 80.67,33.07 80.47,33.07 C17.2 | 76.4,22.91 79.76,19.56 81.38,19.56 C9.2 81.69,19.46 84.94,16.2 89.92,16.2 GLIDE1.P$3 | R2.1 63.91,13.56 66.24,13.56 67.36,14.68 69.19,14.68 70.1,13.77 70.1,13.56 R14.1 70.31,13.26 70.31,9.91 BUT3.2 70.51,9.6 70.51,4.62 BUT3.1 70.21,4.52 69.8,4.52 68.48,3.2 61.06,3.2 59.84,4.42 BUT2.1 | R18.1 3.86,2.9 7.62,2.9 R17.1 7.82,2.9 11.38,2.9 R16.1 11.68,2.9 15.24,2.9 R15.1 15.44,2.9 19,2.9 R19.1 19.3,2.9 22.86,2.9 R20.1 23.06,2.9 26.62,2.9 R21.1 26.92,2.9 30.48,2.9 R22.1 30.68,3.1 34.95,3.1 36.58,4.72 41.25,4.72 43.08,2.9 47.14,2.9 48.67,4.42 BUT1.1 48.97,4.52 50.29,3.2 57.61,3.2 58.93,4.52 59.23,4.52 BUT2.1
  Top 0.61: BUT2.1 59.54,4.62 59.54,9.6 BUT2.2 | R1.1 35.15,27.18 39.52,27.18 39.93,27.58 R13.1 40.23,27.58 42.27,27.58 49.58,20.27 R56.1 49.58,19.96 49.58,10.31 48.97,9.7 BUT1.2 | v51.51,30.23 51.92,30.63 52.83,30.63 C5.2 | v36.27,6.55 34.14,6.55 74238.8 | 68.58,20.17 68.58,18.44 70.81,16.2 76.2,16.2 GATE.P$3 | 83.72,37.64 80.47,37.64 C12.2 | 83.72,37.64 86.97,34.39 JP2.GND 87.17,34.09 91.95,29.31 91.95,21.89 C4.- | CLOCK.E 96.52,52.68 96.52,51.05 94.39,48.92 ISP1.6 94.08,48.82 91.24,45.97 90.22,45.97 R7.1 | CLK_IN.GND 87.78,52.58 87.78,48.11 89.92,45.97 R7.1 | MCP6004-V.11 73.97,47.09 73.97,49.94 76.61,52.58 CV1.GND | 66.55,49.73 66.55,51.77 67.36,52.58 CV2.GND | 66.55,49.73 66.55,47.6 MCP4922.8 | 61.37,49.63 61.37,47.6 MCP4922.12 | 61.37,49.63 58.42,52.58 CV3.GND | 66.55,49.73 61.57,49.73 61.37,49.63 | 83.72,37.64 83.92,37.85 83.92,39.98 89.71,45.77 R7.1 | 61.98,28.8 61.16,28.8 60.76,28.4 60.76,27.69 U1.3 60.76,27.38 60.76,26.47 66.85,20.37 68.38,20.37 68.58,20.17 | 61.98,28.8 62.38,28.4 62.38,27.69 U1.5 | 61.98,28.8 62.59,29.41 62.59,31.85 61.57,32.87 U1.21 61.57,36.52 61.57,37.03 60.66,37.95 53.65,37.95 53.24,37.54 C10.2 52.93,37.34 51.61,38.66 46.94,38.66 REF.2 | INVERTOR.7 44.91,36.83 46.63,38.56 REF.2 | MCP6004-TRIG.11 8.33,42.52 8.33,44.04 10.57,46.28 10.57,52.58 TRIG4.GND 10.87,52.68 19.3,52.68 TRIG3.GND | C3.2 29.67,46.18 25.91,42.42 MCP4922-2.8 25.91,42.11 25.91,41.71 25.09,40.89 21.54,40.89 20.83,41.61 20.83,42.42 MCP4922-2.12 | TRIG2.GND 28.35,52.58 28.35,47.3 29.36,46.28 C3.2 | 38.1,46.48 41.15,46.48 C7.2 41.45,46.48 46.23,46.48 C11.2 | 38.1,46.48 36.78,46.48 C8.2 36.58,46.28 29.97,46.28 C3.2
  Top 0.61: 38.1,46.48 38.1,49.33 37.39,50.04 37.39,52.58 TRIG1.GND | CV4.GND 49.38,52.58 49.38,49.43 46.53,46.58 C11.2 | REF.2 46.74,38.96 46.74,46.38 C11.2
  Bottom 0.61: 24.89,17.63 v19.3,17.63 16.36,17.63 15.04,18.95 11.48,18.95 10.97,18.44 v10.77,18.64 v8.53,18.64 7.52,17.63 v4.47,17.63 | 24.89,17.63 v27.03,17.63 36.07,8.58 36.07,6.76 v36.27,6.55 38.2,6.55 42.77,11.12 48.97,11.12 | v24.89,17.32 24.89,17.63 | GATE.P$3 76.2,16.1 76.2,15.39 70.51,9.7 BUT3.2 | v51.51,30.23 51.51,14.27 48.97,11.73 48.97,11.12 | 48.97,11.12 48.97,9.7 BUT1.2 48.87,9.4 48.87,4.62 BUT1.1 | CV2.GND 67.46,52.68 76.61,52.68 CV1.GND 76.91,52.68 87.68,52.68 CLK_IN.GND | TRIG3.GND 19.41,52.68 28.35,52.68 TRIG2.GND | CV3.GND 58.32,52.68 49.48,52.68 CV4.GND
MISO  (via drill 0.35)
  Top 0.203: v70.31,34.7 66.34,34.7 U1.16
  Bottom 0.203: v70.31,34.7 83.11,34.7 84.63,33.17 87.48,33.17 96.83,42.52 96.83,43.74 ISP1.1
MK0  (via drill 0.35)
  Top 0.254: v31.9,28.91 35.05,28.91 R1.2 | v27.13,26.47 26.11,25.45 26.11,24.94 74151-1.4 | v4.88,14.99 4.88,17.02 5.18,17.32 5.18,18.24 v4.88,18.54
  Bottom 0.254: v31.9,28.91 29.57,28.91 v27.13,26.47 27.03,26.47 20.83,20.27 9.14,20.27 7.42,18.54 v4.88,18.54 | v4.88,14.99 3.15,13.26 U$4.2
MK1  (via drill 0.35)
  Top 0.254: v30.79,20.57 32.61,20.57 R10.2 | v28.75,22.61 25.91,22.61 24.79,23.72 24.79,24.84 74151-1.3 | v13.41,17.63 13.41,19.15 13.01,19.56 v10.87,19.56
  Bottom 0.254: v30.79,20.57 v28.75,22.61 27.64,22.61 24.59,19.56 v10.87,19.56 | v13.41,17.63 9.04,13.26 8.23,13.26 U$4.6
MK2
  Top 0.254: R11.2 28.25,20.57 27.23,20.57 23.57,24.23 23.57,24.84 74151-1.2 23.47,24.94 23.47,26.06 22.96,26.57 21.54,26.57 18.19,23.22 18.19,18.14 13.31,13.26 U$4.10
MK3
  Top 0.254: 74151-1.1 22.25,24.84 22.25,23.72 24.28,21.69 24.28,20.57 R12.2 24.18,20.57 23.88,20.57 22.86,19.56 22.86,16.81 22.05,16 21.95,16 19.2,13.26 18.39,13.26 U$4.14
MK4  (via drill 0.35)
  Top 0.254: 36.68,29.52 39.93,29.52 R13.2 | 36.68,29.52 33.02,33.17 26.42,33.17 25.4,32.16 25.4,29.82 25.3,29.72 24.28,29.72 23.57,30.43 23.57,30.94 74151-1.15 | v25.6,19.56 23.47,19.56 23.27,19.36 23.27,17.83 23.37,17.73 23.37,13.26 U$4.18 | v36.68,29.41 36.68,29.52
  Bottom 0.254: v25.6,19.56 30.79,19.56 36.68,25.45 v36.68,29.41
MOSI  (via drill 0.35)
  Top 0.203: v67.46,33.98 66.34,33.98 U1.15 | v69.29,39.17 68.78,39.17 67.06,40.89 64.82,40.89 64.01,41.71 64.01,42.22 MCP4922.5 63.91,42.32 63.91,42.82 62.79,43.94 v61.27,43.94 | v29.06,38.66 24.18,38.66 23.37,37.85 23.37,37.34 MCP4922-2.5 | v58.73,44.96 v54.86,44.96
  Bottom 0.203: v67.46,33.98 67.46,37.34 v69.29,39.17 69.6,39.47 75.08,39.47 81.89,46.28 94.28,46.28 ISP1.4 | v29.06,38.66 31.6,38.66 37.9,44.96 v54.86,44.96 | v58.73,44.96 60.25,44.96 v61.27,43.94
N$1
  Top 0.254: R14.2 68.28,10.21 67.97,9.91 BUT3.K
N$3
  Top 0.254: MCP6004-TRIG.6 10.87,37.34 11.99,37.34 MCP6004-TRIG.7 12.09,37.34 14.94,37.34 18.9,41.3 18.9,49.02 26.92,57.05 26.92,62.64 28.35,64.06 TRIG2.TIP
N$4
  Top 0.254: MCP6004-TRIG.9 10.87,42.52 11.99,42.52 MCP6004-TRIG.8 11.99,42.62 11.99,43.64 22.66,54.3 22.66,60 27.94,65.28 36.17,65.28 37.29,64.16 TRIG1.TIP
N$5
  Top 0.254: MCP6004-TRIG.14 4.47,42.52 5.69,42.52 MCP6004-TRIG.13 5.69,42.62 5.69,59.18 10.57,64.06 TRIG4.TIP
N$6
  Top 0.254: MCP6004-TRIG.1 4.47,37.34 5.69,37.34 MCP6004-TRIG.2 5.69,37.44 5.69,40.69 6.3,41.3 6.3,49.94 10.87,54.51 11.07,54.51 19.3,62.74 19.3,64.06 TRIG3.TIP
N$7
  Top 0.254: MCP6004-V.9 76.5,47.09 77.62,47.09 MCP6004-V.8 77.62,47.19 77.62,51.97 78.13,52.48 78.13,62.64 76.71,64.06 CV1.TIP
N$8
  Top 0.254: R2.2 61.87,13.46 60.66,13.46 57.1,9.91 BUT2.K
N$10
  Top 0.203: U1.7 64.01,27.69 64.01,33.78 66.85,36.63 73.46,36.63 73.76,36.93 Q2.2 73.86,36.93 79.55,31.24 80.37,31.24 C17.1
N$11
  Top 0.203: U1.8 64.82,27.58 73.56,27.58 73.76,27.38 Q2.1 73.86,27.38 75.69,29.21 78.94,29.21 C18.1
N$17
  Top 0.254: R6.1 95.1,58.47 94.79,58.17 94.79,52.78 CLOCK.B 94.69,52.58 90.22,48.11 90.22,47.9 R7.2
N$25  (via drill 0.35)
  Top 0.254: MCP6004-V.7 77.62,41.81 76.5,41.81 MCP6004-V.6 76.4,41.71 76.4,41.2 75.59,40.39 73.46,40.39 73.25,40.59 73.25,43.03 v71.93,44.35
  Bottom 0.254: v71.93,44.35 71.32,44.35 51.61,64.06 49.48,64.06 CV4.TIP
N$26
  Top 0.254: R6.2 97.03,58.57 97.03,59.08 92.05,64.06 87.78,64.06 CLK_IN.TIP
N$31
  Top 0.254: MCP6004-V.2 71.32,41.81 70.1,41.81 MCP6004-V.1 70,41.81 68.78,41.81 65.94,44.65 60.05,44.65 58.62,46.08 58.42,46.08 57,47.5 57,62.74 58.32,64.06 CV3.TIP
N$36
  Top 0.254: MCP6004-V.13 71.32,47.09 70.1,47.09 MCP6004-V.14 70.1,47.19 70.1,61.42 67.46,64.06 CV2.TIP
N$65
  Top 0.254: R56.2 47.65,19.96 47.65,11.12 46.43,9.91 BUT1.K
POT1
  Top 0.203: U1.19 63.2,36.32 63.2,37.03 64.52,38.35 68.58,38.35 68.89,38.05 70.81,38.05 72.75,39.98 74.88,39.98 79.25,35.61 79.25,34.9 80.06,34.09 81.38,34.09 83.92,31.55 83.92,24.74 92.46,16.2 GLIDE1.P$2
POT2  (via drill 0.35)
  Top 0.254: v61.67,31.55 60.86,32.36 60.86,36.22 U1.22
  Bottom 0.254: v61.67,31.55 63.7,31.55 63.8,31.65 68.48,31.65 78.74,21.39 GATE.P$2
RST
  Top 0.203: U1.29 57.61,31.45 57.1,31.45 56.08,30.43 56.08,26.87 62.08,20.88 65.33,20.88 72.14,14.07 94.69,14.07 98.25,17.63 98.25,47.5 96.93,48.82 ISP1.5
SCK  (via drill 0.35)
  Top 0.203: 64.72,37.34 64.72,36.32 U1.17 | v63.8,40.59 62.69,41.71 62.69,42.22 MCP4922.4 | v55.47,35.92 55.17,36.22 53.03,36.22 51.61,34.8 23.98,34.8 22.15,36.63 22.15,37.24 MCP4922-2.4 | 64.72,37.34 v69.29,37.34 | 64.72,37.34 v64.72,37.64
  Bottom 0.203: v63.8,40.59 64.72,39.68 v64.72,37.64 59.54,32.46 58.93,32.46 v55.47,35.92 | v69.29,37.34 73.46,37.34 81.08,44.96 94.49,44.96 95.81,46.28 96.83,46.28 ISP1.3
T0  (via drill 0.35)
  Top 0.254: R18.2 3.86,4.72 5.79,4.72 6.71,3.81 8.53,3.81 8.74,4.01 8.74,5.54 3.66,10.62 3.15,10.62 U$4.1 | v37.49,14.07 40.23,14.07 74238.15 | v35.66,13.87 35.26,13.46 30.58,13.46 v30.28,13.16
  Bottom 0.254: v37.49,14.07 35.87,14.07 v35.66,13.87 | v30.28,13.16 26.52,9.4 4.37,9.4 3.15,10.62 U$4.1
T1  (via drill 0.35)
  Top 0.254: 4.62,7.42 1.83,10.21 1.83,11.12 2.64,11.94 4.37,11.94 5.59,10.72 U$4.3 | 4.62,7.42 7.21,4.83 7.62,4.83 R17.2 | v41.86,8.99 41.86,11.73 40.84,12.75 40.34,12.75 74238.14 | v38.81,3.81 36.58,3.81 34.65,1.88 2.95,1.88 2.74,2.08 2.74,5.54 4.62,7.42
  Bottom 0.254: v41.86,8.99 41.86,6.86 v38.81,3.81
T2  (via drill 0.35)
  Top 0.254: R16.2 11.38,4.83 11.38,7.47 8.23,10.62 U$4.5 | v37.49,12.95 38.81,11.63 40.23,11.63 74238.13 | v29.26,14.17 v31.7,14.17
  Bottom 0.254: v37.49,12.95 32.92,12.95 v31.7,14.17 | v29.26,14.17 28.75,14.17 26.52,11.94 9.45,11.94 8.23,10.72 U$4.5
T3
  Top 0.254: R15.2 15.24,6.15 10.77,10.62 U$4.7 10.67,10.72 9.45,11.94 5.18,11.94 4.37,12.75 4.37,13.77 1.32,16.81 1.32,29.62 4.47,32.77 14.63,32.77 15.24,32.16 15.24,29.82 17.17,27.89 29.87,27.89 36.78,20.98 36.78,12.65 39.12,10.31 40.23,10.31 74238.12
T4
  Top 0.254: R19.2 19,4.83 13.21,10.62 U$4.9 13.61,10.31 15.24,11.94 16.36,11.94 17.07,12.65 17.07,13.66 18.59,15.19 18.59,23.01 21.74,26.16 22.76,26.16 22.86,26.06 22.86,23.72 23.06,23.52 23.16,23.52 26.31,20.37 26.31,17.32 26.72,16.92 35.56,16.92 36.37,16.1 36.37,12.34 39.62,9.09 40.23,9.09 74238.11
T5
  Top 0.254: R20.2 22.86,4.83 21.64,4.83 15.85,10.62 U$4.11 16.26,10.31 17.88,11.94 26.52,11.94 30.07,8.38 35.26,8.38 35.87,7.77 40.23,7.77 74238.10
T6
  Top 0.254: U$4.13 18.39,10.62 18.9,10.62 24.69,4.83 26.62,4.83 R21.2 26.72,4.72 27.64,3.81 34.54,3.81 37.19,6.45 40.23,6.45 74238.9
T7
  Top 0.254: 74238.7 34.04,7.67 33.53,7.67 30.68,4.83 30.48,4.83 R22.2 30.38,4.83 29.46,5.74 26.62,5.74 21.74,10.62 20.93,10.62 U$4.15
TRIG1
  Top 0.203: U1.28 57.61,32.26 56.79,32.26 53.65,29.11 44.3,29.11 39.22,34.19 14.73,34.19 13.01,35.92 10.36,35.92 10.16,36.12 10.16,39.07 10.26,39.17 10.26,41.2 9.55,41.91 9.55,42.42 MCP6004-TRIG.10
TRIG2  (via drill 0.35)
  Top 0.203: v53.65,35.51 53.95,35.2 55.68,35.2 55.78,35.31 58.42,35.31 59.84,33.88 59.84,32.36 58.22,30.73 57.71,30.73 U1.30 | v10.57,35.2 9.55,36.22 9.55,37.24 MCP6004-TRIG.5
  Bottom 0.203: v53.65,35.51 53.65,42.11 60.25,48.72 60.25,49.33 59.74,49.84 30.07,49.84 23.06,42.82 23.06,38.96 19.71,35.61 17.17,35.61 14.53,32.97 12.8,32.97 v10.57,35.2
TRIG3  (via drill 0.35)
  Top 0.203: v56.79,28.3 56.69,28.4 56.69,29.52 57.1,29.92 57.61,29.92 U1.31 | v32.82,38.46 30.18,38.46 29.26,39.37 22.55,39.37 v22.35,39.17 | v9.55,39.37 8.53,39.37 7.01,37.85 7.01,37.34 MCP6004-TRIG.3
  Bottom 0.203: v56.79,28.3 55.58,28.3 49.07,34.8 36.47,34.8 v32.82,38.46 | v22.35,39.17 9.75,39.17 v9.55,39.37
TRIG4  (via drill 0.35)
  Top 0.254: v58.32,28.3 58.93,27.69 59.13,27.69 U1.1 | v51.41,39.88 51.41,40.18 50.29,41.3 v50.29,50.95 | v8.53,45.47 8.53,45.16 7.01,43.64 7.01,42.52 MCP6004-TRIG.12
  Bottom 0.254: v58.32,28.3 58.32,29.01 51.41,35.92 v51.41,39.88 | v50.29,50.95 14.02,50.95 v8.53,45.47
VOUTA
  Top 0.254: MCP6004-V.10 75.08,46.99 75.08,46.38 73.76,45.06 60.66,45.06 58.93,46.79 58.93,47.5 MCP4922.14
VOUTB
  Top 0.254: MCP4922.10 64.01,47.6 64.01,48.21 64.72,48.92 65.63,48.92 65.84,48.72 65.84,46.28 66.55,45.57 71.73,45.57 72.54,46.38 72.54,46.99 MCP6004-V.12
VOUTC  (via drill 0.35)
  Top 0.254: v23.37,54.51 23.37,54.41 18.29,49.33 18.29,42.52 MCP4922-2.14 | v68.78,43.54 71.42,43.54 72.54,42.42 72.54,41.81 MCP6004-V.3
  Bottom 0.254: v23.37,54.51 56.9,54.51 57.61,53.8 58.83,53.8 68.78,43.84 v68.78,43.54
VOUTD
  Top 0.254: MCP4922-2.10 23.37,42.52 23.37,52.27 28.75,57.66 45.11,57.66 52.73,65.28 77.11,65.28 78.54,63.86 78.54,45.77 75.18,42.42 75.18,41.81 MCP6004-V.5

### Text on the board
bNames: KeyBoard / Controller | Pure Keys / Dev Board / PCB 3 SMD / GMSN! and / Andy C